# EasyEDA Pro project HighwaySchematic.epro

# Schematic Schematic1
Board Name: Board1; Create Date: 2025-05-22; Page Name: P1; Project Name: HighwayDrivingDevice; Schematic Name: Schematic1; Update Date: 2025-05-22; Company: EasyEDA.com; Page Size: A4; Version: V1.0
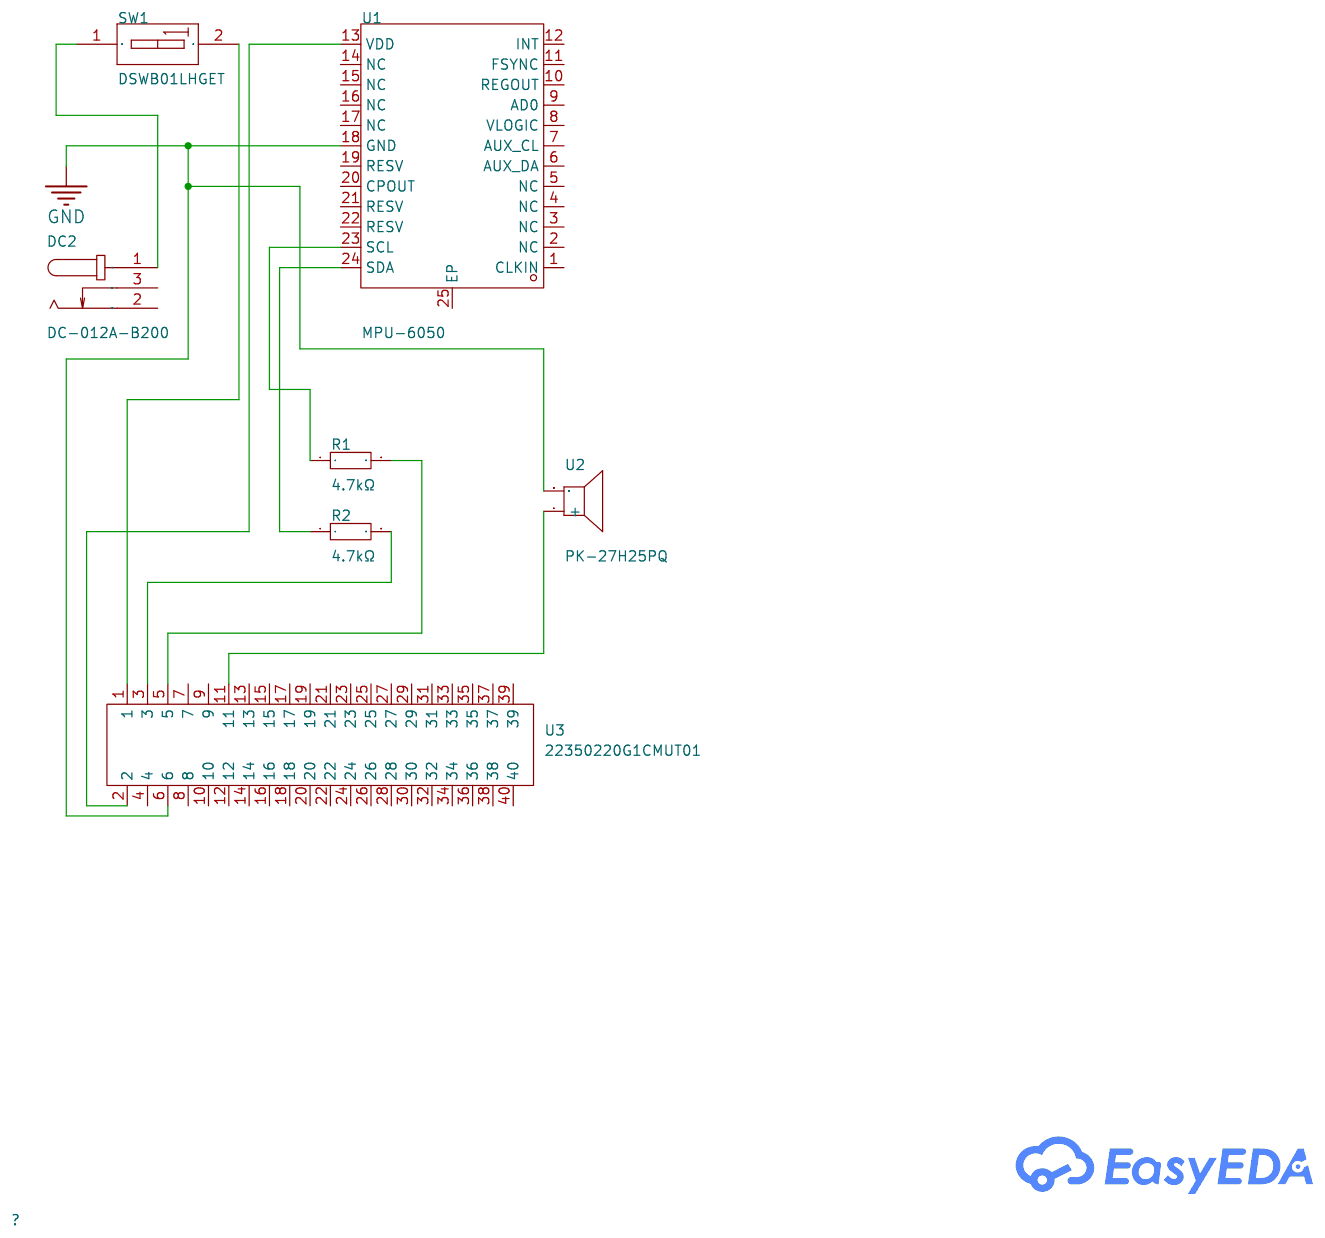
[diagram p0: schematic sheet]

## Parts
DC2  DC-012A-B200  [DC-IN-TH_DC-012A-B200]
R1  4.7kΩ  [R0603]
R2  4.7kΩ  [R0603]
SW1  DSWB01LHGET  [SW-TH_DSWB01LHGET]
U1  MPU-6050  [QFN-24_L4.0-W4.0-P0.50-BL-EP2.7]
U2  PK-27H25PQ  [BUZ-TH_BD30.0-P15.00-D0.8]
U3  22350220G1CMUT01  [HDR-SMD_40P-P2.54-V-F-R2-C20-S6.6-EH]

## Library data of the parts
DC2 = DC-012A-B200: Connector Type:DC Power Receptacle Mounting Style:Direct Insert Inside Contact Diameter:2mm Outside Contact Diameter:6.4mm Current Rating (Max):2A Voltage Rating (Max):30V Operating Temperature Range:-20℃~+70℃ Operating Temperature Range:-20℃~+70℃; LCSC Part Name: DC电源插座 内径:2mm 外径:6.4mm; Supplier Part: C720563; Manufacturer: XUNPU(讯普); Supplier Footprint: 插件; JLCPCB Part Class: Extended Part; Datasheet: https://atta.szlcsc.com/upload/public/pdf/source/20240417/4D93A3C67534E4D912C478BF4A94DB25.pdf; Supplier: LCSC; Connector Type: DC Power Receptacle; Mounting Style: Direct Insert; Inside Contact Diameter: 2mm; Outside Contact Diameter: 6.4mm; Current Rating (Max): 2A; Voltage Rating (Max): 30V; Operating Temperature Range: -20℃~+70℃
R1 R2 = RC0603FR-074K7L: Type:Thick Film Resistors Resistance: Tolerance:±1% Tolerance:±1% Power(Watts): Overload Voltage (Max): Temperature Coefficient:±100ppm/℃ Temperature Coefficient:±100ppm/℃ Operating Temperature Range:-55℃~+155℃ Operating Temperature Range:-55℃~+155℃; LCSC Part Name: 厚膜电阻 4.7kΩ ±1% 100mW; Supplier Part: C99782; Manufacturer: YAGEO(国巨); Supplier Footprint: 0603; JLCPCB Part Class: Extended Part; Datasheet: https://atta.szlcsc.com/upload/public/pdf/source/20180224/C181757_15194369480721363983.pdf; Supplier: LCSC; Type: Thick Film Resistors; Tolerance: ±1%; Temperature Coefficient: ±100ppm/℃; Operating Temperature Range: -55℃~+155℃
SW1 = DSWB01LHGET: Type:平拨,凸起式 Circuit:SPST Number of Positions:1Bit Lead Pitch:- Operating Life:- Color:Red; LCSC Part Name: 红色宽体1位顶拨插件; Supplier Part: C126888; Manufacturer: YE; Supplier Footprint: 插件,9.9x4mm; JLCPCB Part Class: Extended Part; Datasheet: https://atta.szlcsc.com/upload/public/pdf/source/20240423/2AB41BE17D24959C6789B2A71E54D492.pdf; Supplier: LCSC; Type: 平拨,凸起式; Circuit: SPST; Number of Positions: 1Bit; Color: Red
U1 = MPU-6050: Sensor Type:加速度计陀螺仪 Operating Temperature:-40℃~+85℃ Operating Temperature:-40℃~+85℃; Supplier Part: C24112; Manufacturer: TDK InvenSense(应美盛); Supplier Footprint: QFN-24-EP(4x4); JLCPCB Part Class: Extended Part; Datasheet: https://atta.szlcsc.com/upload/public/pdf/source/20140425/1457707046159.pdf; Supplier: LCSC; Sensor Type: 加速度计陀螺仪; Operating Temperature: -40℃~+85℃
U2 = PK-27H25PQ: Supplier Part: C6735162; Manufacturer: Mallory Sonalert Products Inc; Supplier Footprint: 插件; JLCPCB Part Class: Extended Part; Datasheet: https://atta.szlcsc.com/upload/public/pdf/source/231023/PK-27H25PQ.pdf-c24a1fc2dcf9e065120887738120f0ad.pdf; Supplier: LCSC
U3 = 22350220G1CMUT01: Supplier Part: C9900176214; Supplier Footprint: SMD-2X20P-2.0; JLCPCB Part Class: Extended Part; Supplier: LCSC

## Nets
GND: U1.18(GND) U2.2 U3.6
Net-(DC2-1): DC2.1 SW1.1(A1)
Net-(R1-1): R1.1 U1.23(SCL)
Net-(R1-2): R1.2 U3.5
Net-(R2-1): R2.1 U1.24(SDA)
Net-(R2-2): R2.2 U3.3
Net-(SW1-2): SW1.2 U3.1
Net-(U1-13): U1.13(VDD) U3.2
Net-(U2-1): U2.1(+) U3.11

Not connected (* = marked no-connect by the designer): DC2 2 3; U1 1(CLKIN) 2(NC) 3(NC) 4(NC) 5(NC) 6(AUX_DA) 7(AUX_CL) 8(VLOGIC) 9(AD0) 10(REGOUT) 11(FSYNC) 12(INT) 14(NC) 15(NC) 16(NC) 17(NC) 19(RESV) 20(CPOUT) 21(RESV) 22(RESV) 25(EP); U3 4 7 8 9 10 12 13 14 15 16 17 18 19 20 21 22 23 24 25 26 27 28 29 30 31 32 33 34 35 36 37 38 39 40
